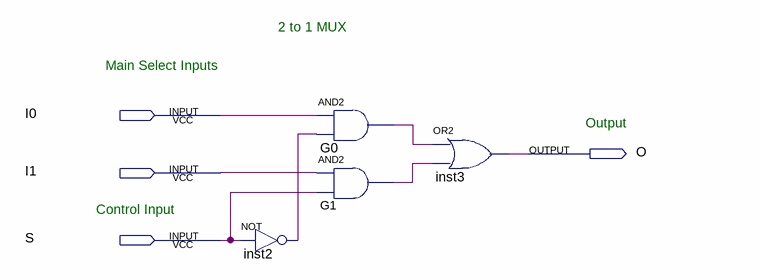
[diagram p0: schematic sheet]
// Quartus schematic 2_to_1_MUX.bdf as structural Verilog: 4 symbols, 4 pins
module \2_to_1_MUX  (
  input  I0,
  input  I1,
  input  S,
  output O
);

  wire G0_out, G1_out, inst2_out;

  not inst2 (inst2_out, S);
  and G0 (G0_out, I0, inst2_out);
  and G1 (G1_out, I1, S);
  or inst3 (O, G0_out, G1_out);

  // Notes on the sheet:
  //   2 to 1 MUX
  //   Main Select Inputs
  //   Output
  //   Control Input
endmodule
